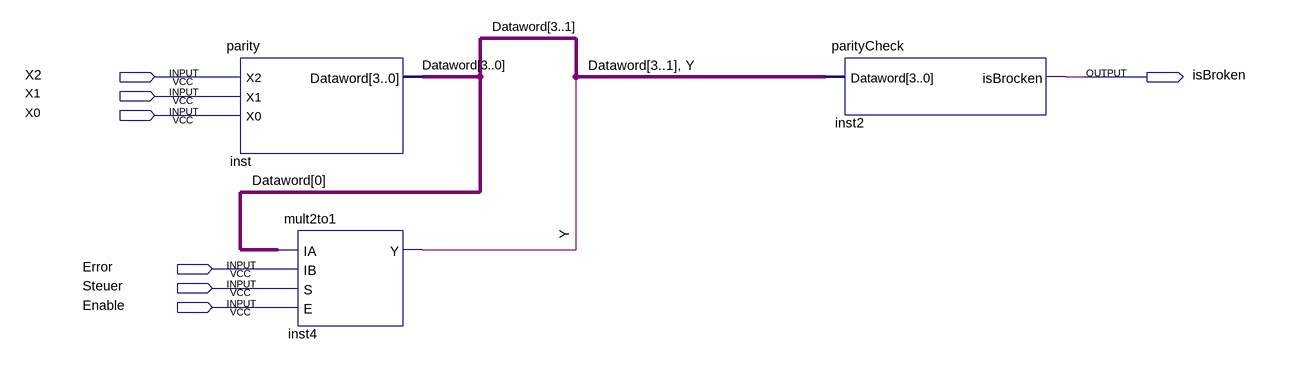
[diagram p0: schematic sheet]
// Quartus schematic errorGenerator.bdf as structural Verilog: 3 symbols, 7 pins
module errorGenerator (
  input  X2,
  input  X1,
  input  X0,
  input  Error,
  input  Steuer,
  input  Enable,
  output isBroken
);

  wire Y;
  wire [3:0] Dataword;

  parity inst (.X2(X2), .X1(X1), .X0(X0), .Dataword(Dataword));
  mult2to1 inst4 (.IA(Dataword[0]), .IB(Error), .S(Steuer), .E(Enable), .Y(Y));
  parityCheck inst2 (.Dataword({Dataword[3:1], Y}), .isBrocken(isBroken));
endmodule
